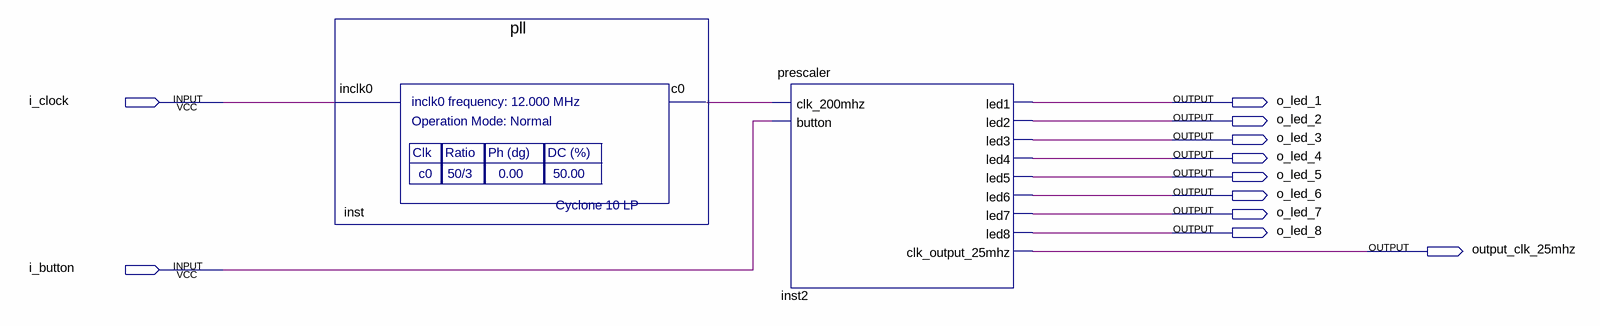
[diagram p0: schematic sheet]
// Quartus schematic p1.bdf as structural Verilog: 2 symbols, 11 pins
module p1 (
  input  i_clock,
  input  i_button,
  output o_led_1,
  output o_led_2,
  output o_led_3,
  output o_led_4,
  output o_led_5,
  output o_led_6,
  output o_led_7,
  output o_led_8,
  output output_clk_25mhz
);

  wire inst_c0;

  pll inst (.inclk0(i_clock), .c0(inst_c0));
  prescaler inst2 (
    .clk_200mhz(inst_c0), .button(i_button), .led1(o_led_1), .led2(o_led_2), .led3(o_led_3), .led4(o_led_4),
    .led5(o_led_5), .led6(o_led_6), .led7(o_led_7), .led8(o_led_8), .clk_output_25mhz(output_clk_25mhz));
endmodule
